# Altium schematic sheet CATS_GS-Telemetry.SchDoc: CATS Groundstation
size A4; DocumentNumber: Subtitle; Revision: V1.0; SheetNumber: 6; SheetTotal: 9; Author: Luca Jost; Subtitle: Telemetry
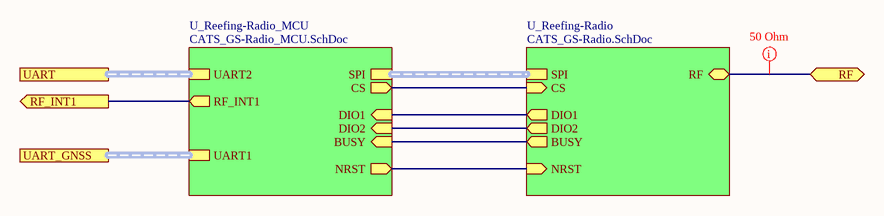
[diagram p0: CATS_GS-Telemetry.SchDoc]

## Sub-sheets
U_Reefing-Radio = CATS_GS-Radio.SchDoc: SPI (harness SPI), CS (in), BUSY (out), DIO1 (out), DIO2 (out), RF (bidir), NRST (in)
U_Reefing-Radio_MCU = CATS_GS-Radio_MCU.SchDoc: SPI (harness SPI), RF_INT1 (out), UART2 (harness UART), BUSY (in), DIO2 (in), DIO1 (in), CS (out), UART1 (harness UART), NRST (out)

## Ports
RF (bidir), RF_INT1 (out), UART, UART_GNSS

## Nets
RF: port RF, sheet U_Reefing-Radio/RF
RF_INT1: port RF_INT1, sheet U_Reefing-Radio_MCU/RF_INT1
(unnamed): sheet U_Reefing-Radio/CS, sheet U_Reefing-Radio_MCU/CS
(unnamed): sheet U_Reefing-Radio/BUSY, sheet U_Reefing-Radio_MCU/BUSY
(unnamed): sheet U_Reefing-Radio/DIO1, sheet U_Reefing-Radio_MCU/DIO1
(unnamed): sheet U_Reefing-Radio/DIO2, sheet U_Reefing-Radio_MCU/DIO2
(unnamed): sheet U_Reefing-Radio/NRST, sheet U_Reefing-Radio_MCU/NRST

## Buses and harness runs
harness port UART = sheet U_Reefing-Radio_MCU/UART2
harness port UART_GNSS = sheet U_Reefing-Radio_MCU/UART1
harness sheet U_Reefing-Radio/SPI = sheet U_Reefing-Radio_MCU/SPI

## Layout directives
rule Impedance Constraint [Min = 50.00    Max = 50.00    ]; net class RF-Line 50: RF

## Notes on the sheet
- Title
- Author:
- Subtitle
- Date:
- Rev:
- File:
- Sheet
- of